# Altium schematic sheet TC2117-3.3VDBTR1_TC2117-3.3VDBTR.schdoc
size 124 x 101 mm
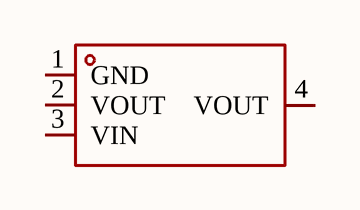
[diagram p0: TC2117-3.3VDBTR1_TC2117-3.3VDBTR.schdoc]

## Parts
U?  TC2117-3.3VDBTR  [SOT-223_L6.5-W3.5-P2.30-LS7.0-BR]  (value not drawn)

## Nets

Not connected (* = marked no-connect by the designer): U? 1(GND) 2(VOUT) 3(VIN) 4(VOUT)

## Library data of the parts
U? = TC2117-3.3VDBTR: Manufacturer: MICROCHIP(美国微芯); Add into BOM: yes; Output Type: 固定; Maximum Input Voltage: 6V; Output Voltage: 3.3V; MAX Output Current: 800mA; Power Supply Rejection Ratio (PSRR): 55dB@(1kHz); Dropout Voltage: 1.2V@(800mA); standby current: 130uA; Output Polarity: 正极; Number of Outputs: 1; Symbol: TC2117-3.3VDBTR; Device: TC2117-3.3VDBTR; LCSC Part Name: 输入6V 输出3.3V 800mA; Supplier Part: C98655; Manufacturer Part: TC2117-3.3VDBTR; Supplier Footprint: SOT-223; JLCPCB Part Class: Extended Part; Datasheet: https://atta.szlcsc.com/upload/public/pdf/source/20180115/C98655_15159960630471267638.pdf; Supplier: LCSC; Convert to PCB: yes; Operating Temperature: -40℃~+125℃@(Tj)